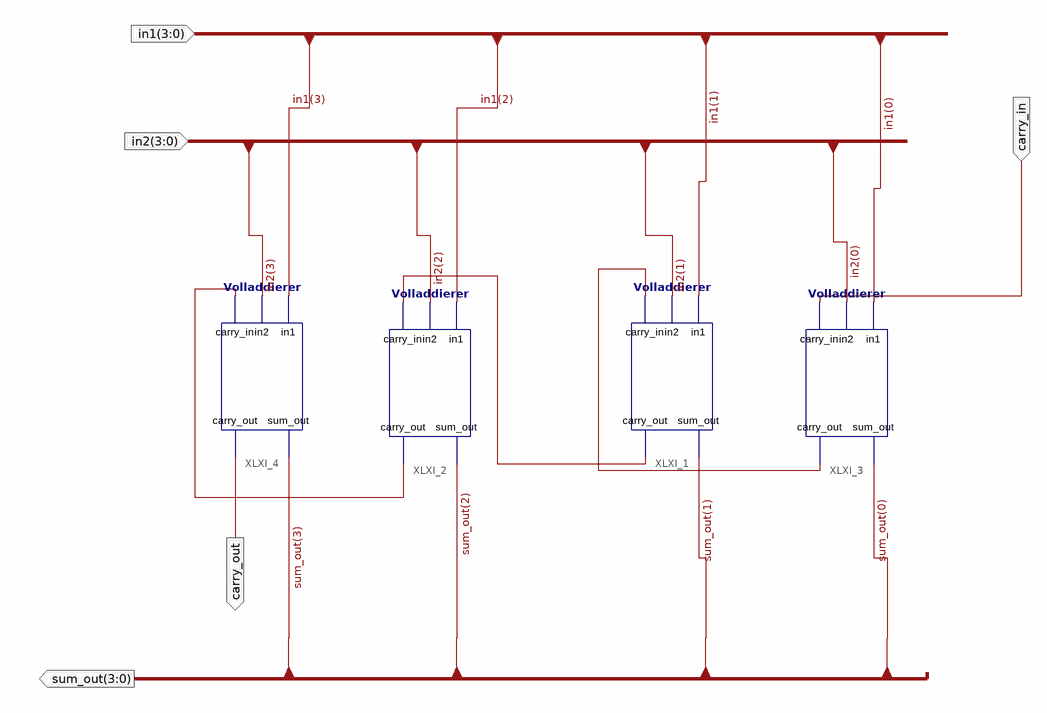
[diagram p0: schematic sheet 1]
// Xilinx ISE schematic Ripple_Carry_4b.sch (spartan3e) as structural Verilog: 4 symbols, 5 ports
module Ripple_Carry_4b (
  input  [3:0] in1,
  input  [3:0] in2,
  input  carry_in,
  output carry_out,
  output [3:0] sum_out
);

  wire XLXN_9, XLXN_10, XLXN_11;

  Volladdierer XLXI_1 (.in1(in1[1]), .in2(in2[1]), .carry_in(XLXN_9), .sum_out(sum_out[1]), .carry_out(XLXN_10));
  Volladdierer XLXI_2 (.in1(in1[2]), .in2(in2[2]), .carry_in(XLXN_10), .sum_out(sum_out[2]), .carry_out(XLXN_11));
  Volladdierer XLXI_3 (.in1(in1[0]), .in2(in2[0]), .carry_in(carry_in), .sum_out(sum_out[0]), .carry_out(XLXN_9));
  Volladdierer XLXI_4 (.in1(in1[3]), .in2(in2[3]), .carry_in(XLXN_11), .sum_out(sum_out[3]), .carry_out(carry_out));
endmodule
